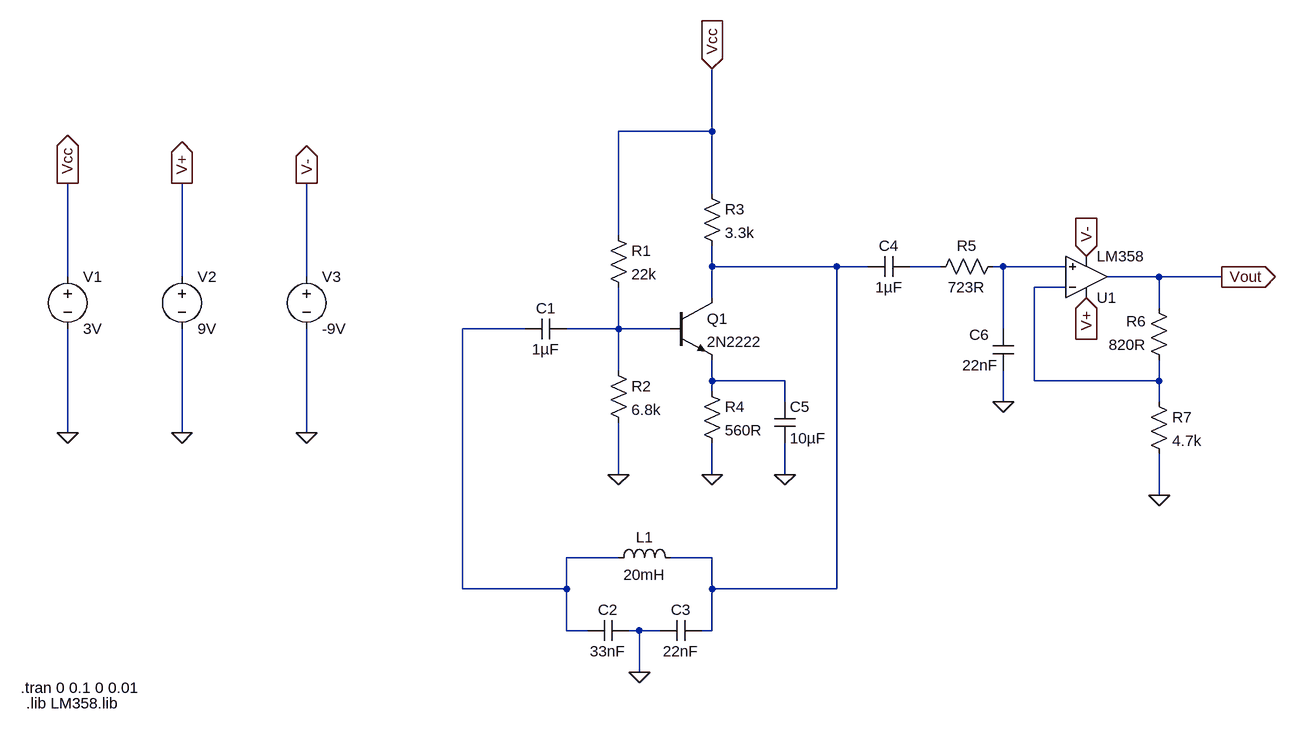
[diagram p0: schematic emulator-vertical-ct-sim.asc]
emulator-vertical-ct-sim.asc, the LTspice schematic file:
Version 4
SHEET 1 1264 720
WIRE 368 -176 368 -272
WIRE 368 -176 224 -176
WIRE 368 -80 368 -176
WIRE 224 -16 224 -176
WIRE 368 32 368 0
WIRE 560 32 368 32
WIRE 608 32 560 32
WIRE 720 32 672 32
WIRE 816 32 800 32
WIRE 912 32 816 32
WIRE -624 48 -624 -96
WIRE -448 48 -448 -96
WIRE -256 48 -256 -96
WIRE 1056 48 976 48
WIRE 1152 48 1056 48
WIRE 912 64 864 64
WIRE 368 80 368 32
WIRE 1056 96 1056 48
WIRE 80 128 -16 128
WIRE 224 128 224 64
WIRE 224 128 144 128
WIRE 304 128 224 128
WIRE 816 128 816 32
WIRE 224 192 224 128
WIRE 368 208 368 176
WIRE 480 208 368 208
WIRE 864 208 864 64
WIRE 1056 208 1056 176
WIRE 1056 208 864 208
WIRE 368 224 368 208
WIRE 480 240 480 208
WIRE 816 240 816 192
WIRE 1056 240 1056 208
WIRE -624 288 -624 128
WIRE -448 288 -448 128
WIRE -256 288 -256 128
WIRE 224 352 224 272
WIRE 368 352 368 304
WIRE 480 352 480 304
WIRE 1056 384 1056 320
WIRE 224 480 144 480
WIRE 368 480 304 480
WIRE -16 528 -16 128
WIRE 144 528 144 480
WIRE 144 528 -16 528
WIRE 368 528 368 480
WIRE 560 528 560 32
WIRE 560 528 368 528
WIRE 144 592 144 528
WIRE 176 592 144 592
WIRE 256 592 240 592
WIRE 288 592 256 592
WIRE 368 592 368 528
WIRE 368 592 352 592
WIRE 256 656 256 592
FLAG 224 352 0
FLAG 368 352 0
FLAG 256 656 0
FLAG 1152 48 Vout
IOPIN 1152 48 Out
FLAG 480 352 0
FLAG 368 -272 Vcc
IOPIN 368 -272 In
FLAG -624 -96 Vcc
IOPIN -624 -96 Out
FLAG -624 288 0
FLAG 944 80 V+
IOPIN 944 80 In
FLAG 944 16 V-
IOPIN 944 16 In
FLAG 1056 384 0
FLAG -448 -96 V+
IOPIN -448 -96 Out
FLAG -448 288 0
FLAG -256 -96 V-
IOPIN -256 -96 Out
FLAG -256 288 0
FLAG 816 240 0
SYMBOL cap 144 112 R90
WINDOW 0 0 32 VBottom 2
WINDOW 3 32 32 VTop 2
SYMATTR InstName C1
SYMATTR Value 1µF
SYMBOL res 208 -32 R0
SYMATTR InstName R1
SYMATTR Value 22k
SYMBOL res 208 176 R0
SYMATTR InstName R2
SYMATTR Value 6.8k
SYMBOL npn 304 80 R0
SYMATTR InstName Q1
SYMATTR Value 2N2222
SYMBOL res 352 -96 R0
SYMATTR InstName R3
SYMATTR Value 3.3k
SYMBOL res 352 208 R0
SYMATTR InstName R4
SYMATTR Value 560R
SYMBOL ind 208 496 R270
WINDOW 0 32 56 VTop 2
WINDOW 3 5 56 VBottom 2
SYMATTR InstName L1
SYMATTR Value 20mH
SYMBOL cap 240 576 R90
WINDOW 0 0 32 VBottom 2
WINDOW 3 32 32 VTop 2
SYMATTR InstName C2
SYMATTR Value 33nF
SYMBOL cap 352 576 R90
WINDOW 0 0 32 VBottom 2
WINDOW 3 32 32 VTop 2
SYMATTR InstName C3
SYMATTR Value 22nF
SYMBOL cap 672 16 R90
WINDOW 0 0 32 VBottom 2
WINDOW 3 32 32 VTop 2
SYMATTR InstName C4
SYMATTR Value 1µF
SYMBOL cap 464 240 R0
SYMATTR InstName C5
SYMATTR Value 10µF
SYMBOL voltage -624 32 R0
SYMATTR InstName V1
SYMATTR Value 3V
SYMBOL OpAmps\\opamp2 944 112 M180
SYMATTR InstName U1
SYMATTR Value LM358
SYMBOL res 816 16 R90
WINDOW 0 0 56 VBottom 2
WINDOW 3 32 56 VTop 2
SYMATTR InstName R5
SYMATTR Value 723R
SYMBOL res 1072 192 R180
WINDOW 0 36 76 Left 2
WINDOW 3 36 40 Left 2
SYMATTR InstName R6
SYMATTR Value 820R
SYMBOL res 1040 224 R0
SYMATTR InstName R7
SYMATTR Value 4.7k
SYMBOL voltage -448 32 R0
SYMATTR InstName V2
SYMATTR Value 9V
SYMBOL voltage -256 32 R0
SYMATTR InstName V3
SYMATTR Value -9V
SYMBOL cap 800 128 R0
WINDOW 0 -36 9 Left 2
WINDOW 3 -47 56 Left 2
SYMATTR InstName C6
SYMATTR Value 22nF
TEXT -696 680 Left 2 !.tran 0 0.1 0 0.01
TEXT -688 704 Left 2 !.lib LM358.lib

The netlist it stands for:
* emulator-vertical-ct-sim.asc
C1 N006 N005 1µF
R1 Vcc N006 22k
R2 N006 0 6.8k
Q1 N001 N006 N007 0 2N2222
R3 Vcc N001 3.3k
R4 N007 0 560R
L1 N005 N001 20mH
C2 0 N005 33nF
C3 N001 0 22nF
C4 N002 N001 1µF
C5 N007 0 10µF
V1 Vcc 0 3V
XU1 N003 N004 V+ V- Vout LM358  ; pins In+ In- V+ V- OUT
R5 N003 N002 723R
R6 N004 Vout 820R
R7 N004 0 4.7k
V2 V+ 0 9V
V3 V- 0 -9V
C6 N003 0 22nF
.model NPN NPN
.model PNP PNP
.lib standard.bjt
.tran 0 0.1 0 0.01
.lib LM358.lib
.backanno
.end